# Altium schematic sheet Decaps.SchDoc
size A; SheetNumber: 5; SheetTotal: 5
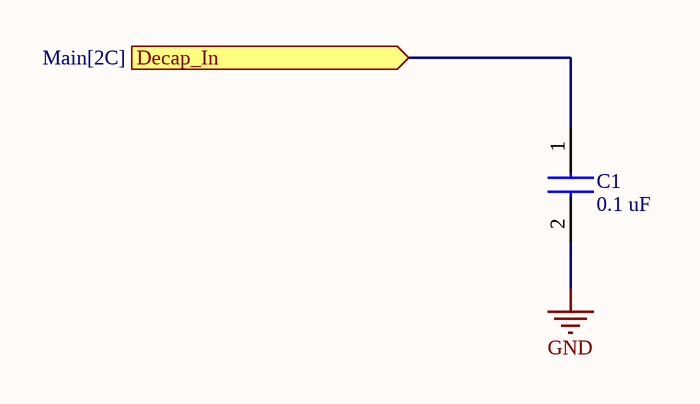
[diagram p0: Decaps.SchDoc]

## Parts
C1  0.1 uF  [C0603]

## Ports
Decap_In (in, see Main[2C])

## Nets
GND: C1.2
Decap_In: C1.1 ; port Decap_In

## Library data of the parts
C1 = C0603C104K5RAC7411: Manufacturer_Name: KEMET; Datasheet Link: https://content.kemet.com/datasheets/KEM_C1002_X7R_SMD.pdf; Height: 0.87mm; Manufacturer_Part_Number: C0603C104K5RAC7411; Mouser Part Number: 80-C0603C104K5R7411; Mouser Price/Stock: https://www.mouser.co.uk/ProductDetail/KEMET/C0603C104K5RAC7411?qs=JxH5GSBHSCRTO9iUpWbJFg%3D%3D; Arrow Part Number: C0603C104K5RAC7411; Arrow Price/Stock: https://www.arrow.com/en/products/c0603c104k5rac7411/kemet-corporation?region=nac